# EAGLE schematic Channel Display v1 (EAGLE 6.6.0)
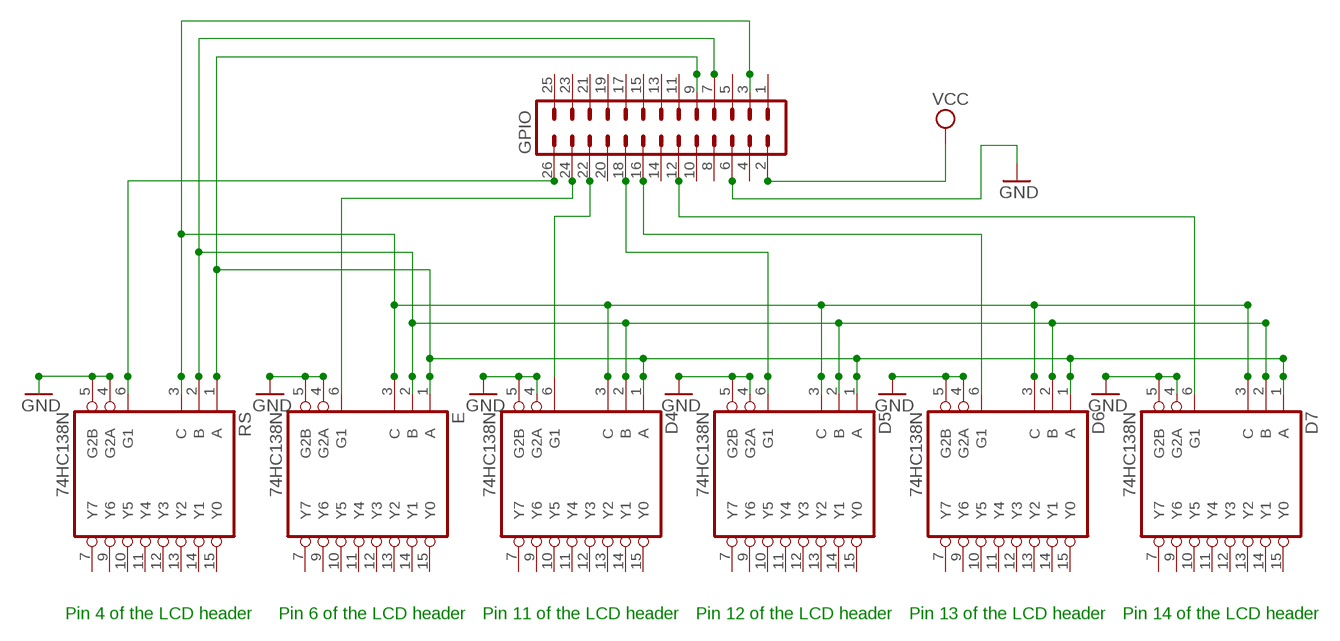
[diagram p0: schematic, sheet 1]

## Parts
D4  74HC138N  [DIL16]
D5  74HC138N  [DIL16]
D6  74HC138N  [DIL16]
D7  74HC138N  [DIL16]
E  74HC138N  [DIL16]
GPIO  MA13-2  [MA13-2]
RS  74HC138N  [DIL16]

## Nets
GND: D4.4(G2A) D4.5(G2B) D5.4(G2A) D5.5(G2B) D6.4(G2A) D6.5(G2B) D7.4(G2A) D7.5(G2B) E.4(G2A) E.5(G2B) GPIO.6 RS.4(G2A) RS.5(G2B)
N$1: D4.3(C) D5.3(C) D6.3(C) D7.3(C) E.3(C) GPIO.3 RS.3(C)
N$2: D4.2(B) D5.2(B) D6.2(B) D7.2(B) E.2(B) GPIO.7 RS.2(B)
N$3: D4.1(A) D5.1(A) D6.1(A) D7.1(A) E.1(A) GPIO.9 RS.1(A)
N$4: GPIO.26 RS.6(G1)
N$5: GPIO.24
N$6: D4.6(G1) GPIO.22
N$7: D5.6(G1) GPIO.18
N$8: GPIO.16
N$9: GPIO.12
VCC: GPIO.2
Unconnected: D4.7(Y7) D4.9(Y6) D4.10(Y5) D4.11(Y4) D4.12(Y3) D4.13(Y2) D4.14(Y1) D4.15(Y0) D5.7(Y7) D5.9(Y6) D5.10(Y5) D5.11(Y4) D5.12(Y3) D5.13(Y2) D5.14(Y1) D5.15(Y0) D6.6(G1) D6.7(Y7) D6.9(Y6) D6.10(Y5) D6.11(Y4) D6.12(Y3) D6.13(Y2) D6.14(Y1) D6.15(Y0) D7.6(G1) D7.7(Y7) D7.9(Y6) D7.10(Y5) D7.11(Y4) D7.12(Y3) D7.13(Y2) D7.14(Y1) D7.15(Y0) E.6(G1) E.7(Y7) E.9(Y6) E.10(Y5) E.11(Y4) E.12(Y3) E.13(Y2) E.14(Y1) E.15(Y0) GPIO.1 GPIO.4 GPIO.5 GPIO.8 GPIO.10 GPIO.11 GPIO.13 GPIO.14 GPIO.15 GPIO.17 GPIO.19 GPIO.20 GPIO.21 GPIO.23 GPIO.25 RS.7(Y7) RS.9(Y6) RS.10(Y5) RS.11(Y4) RS.12(Y3) RS.13(Y2) RS.14(Y1) RS.15(Y0)

## Notes on the sheet
- Pin 4 of the LCD header | Pin 6 of the LCD header | Pin 11 of the LCD header | Pin 12 of the LCD header | Pin 13 of the LCD header | Pin 14 of the LCD header

## Power pins joined to a net without a drawn wire
GND: D4.8(GND) D5.8(GND) D6.8(GND) D7.8(GND) E.8(GND) RS.8(GND)
VCC: D4.16(VCC) D5.16(VCC) D6.16(VCC) D7.16(VCC) E.16(VCC) RS.16(VCC)

## Library data of the parts
D4-D7 E RS = 74xx-eu:74*138: 3-line to 8-line DECODER/DEMULTIPLEXER
GPIO = con-lstb:MA13-2: PIN HEADER; OC_FARNELL: unknown; OC_NEWARK: unknown